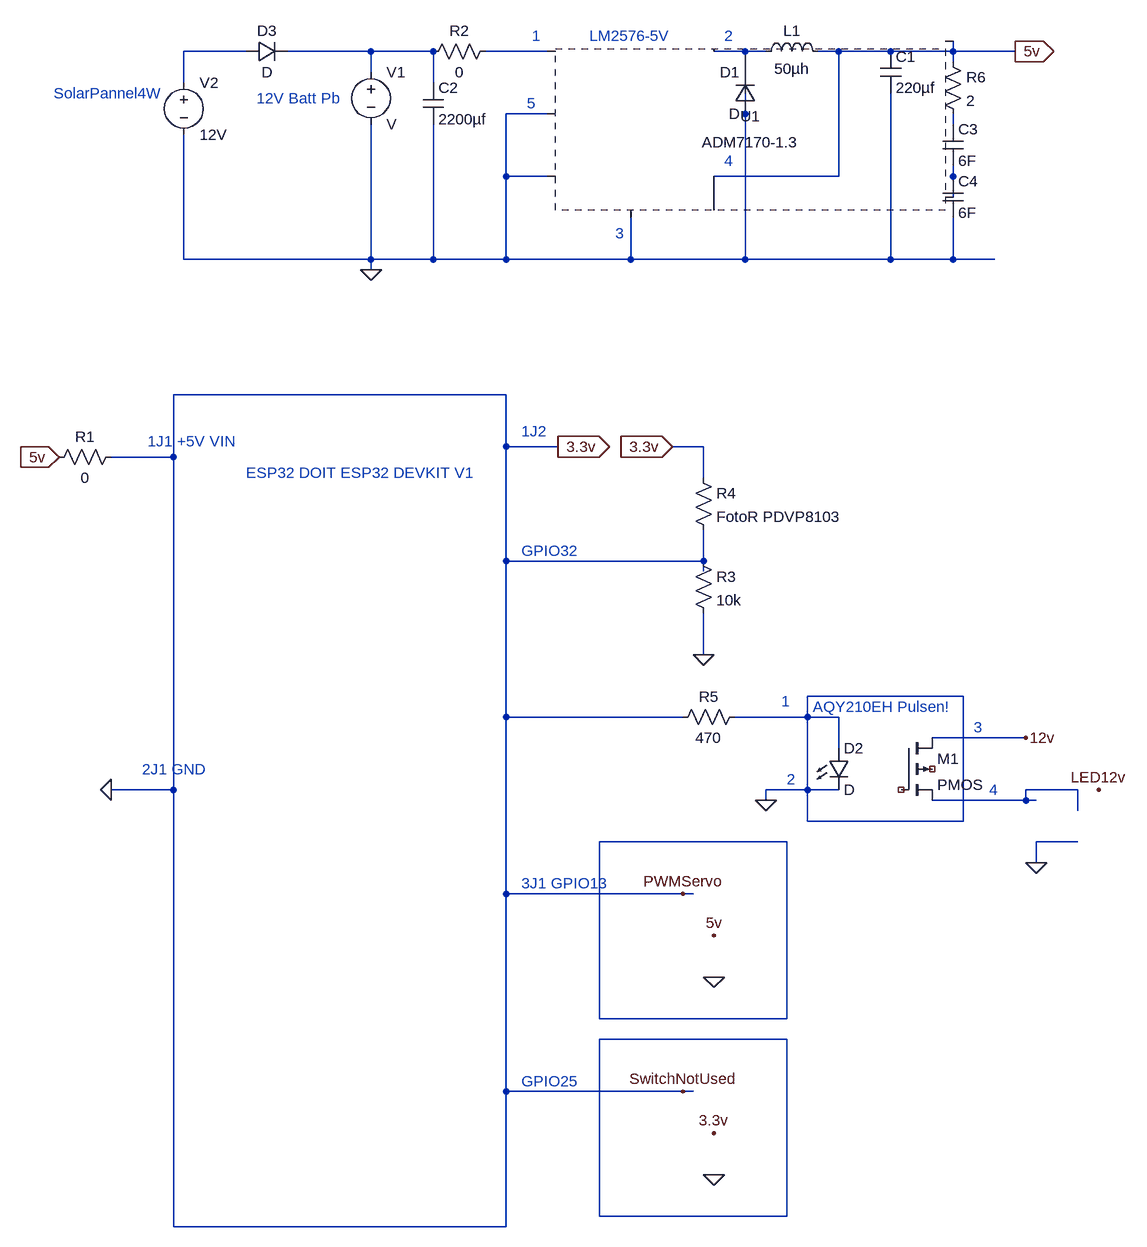
[diagram p0: schematic LTSPICE_Schematics.asc]
LTSPICE_Schematics.asc, the LTspice schematic file:
Version 4
SHEET 1 2716 1220
WIRE 1344 -592 1248 -592
WIRE 1536 -592 1408 -592
WIRE 1632 -592 1536 -592
WIRE 1808 -592 1712 -592
WIRE 2112 -592 2064 -592
WIRE 2144 -592 2112 -592
WIRE 2256 -592 2224 -592
WIRE 2336 -592 2256 -592
WIRE 2432 -592 2432 -608
WIRE 2432 -592 2336 -592
WIRE 2528 -592 2432 -592
WIRE 2432 -576 2432 -592
WIRE 1536 -560 1536 -592
WIRE 2112 -560 2112 -592
WIRE 1248 -544 1248 -592
WIRE 1632 -544 1632 -592
WIRE 1808 -496 1744 -496
WIRE 2112 -496 2112 -528
WIRE 2432 -480 2432 -496
WIRE 1744 -400 1744 -496
WIRE 1808 -400 1744 -400
WIRE 2256 -400 2256 -592
WIRE 2256 -400 2064 -400
WIRE 2432 -400 2432 -416
WIRE 2432 -368 2432 -400
WIRE 1248 -272 1248 -464
WIRE 1536 -272 1536 -480
WIRE 1536 -272 1248 -272
WIRE 1632 -272 1632 -480
WIRE 1632 -272 1536 -272
WIRE 1744 -272 1744 -400
WIRE 1744 -272 1632 -272
WIRE 1936 -272 1936 -336
WIRE 1936 -272 1744 -272
WIRE 2112 -272 2112 -496
WIRE 2112 -272 1936 -272
WIRE 2336 -272 2336 -528
WIRE 2336 -272 2112 -272
WIRE 2432 -272 2432 -336
WIRE 2432 -272 2336 -272
WIRE 2496 -272 2432 -272
WIRE 1536 -256 1536 -272
WIRE 1744 -64 1232 -64
WIRE 1744 16 1744 -64
WIRE 1824 16 1744 16
WIRE 2048 16 2000 16
WIRE 1232 32 1232 -64
WIRE 1232 32 1136 32
WIRE 2048 64 2048 16
WIRE 1744 192 1744 16
WIRE 2048 192 2048 144
WIRE 2048 192 1744 192
WIRE 2048 208 2048 192
WIRE 2048 336 2048 272
WIRE 2448 400 2208 400
WIRE 1744 432 1744 192
WIRE 2016 432 1744 432
WIRE 2208 432 2208 400
WIRE 2208 432 2096 432
WIRE 2256 432 2208 432
WIRE 2544 464 2400 464
WIRE 2256 480 2256 432
WIRE 1232 544 1232 32
WIRE 1232 544 1136 544
WIRE 2208 544 2208 432
WIRE 2208 544 2144 544
WIRE 2256 544 2208 544
WIRE 2624 544 2544 544
WIRE 2144 560 2144 544
WIRE 2544 560 2544 544
WIRE 2544 560 2400 560
WIRE 2560 560 2544 560
WIRE 2624 576 2624 544
WIRE 2208 592 2208 544
WIRE 2448 592 2448 400
WIRE 2448 592 2208 592
WIRE 2176 624 1888 624
WIRE 2624 624 2560 624
WIRE 2560 656 2560 624
WIRE 1744 704 1744 432
WIRE 2016 704 1744 704
WIRE 2032 704 2016 704
WIRE 1888 896 1888 624
WIRE 2176 896 2176 624
WIRE 2176 896 1888 896
WIRE 2176 928 1888 928
WIRE 1744 1008 1744 704
WIRE 2016 1008 1744 1008
WIRE 2032 1008 2016 1008
WIRE 1888 1200 1888 928
WIRE 2176 1200 2176 928
WIRE 2176 1200 1888 1200
WIRE 1232 1216 1232 544
WIRE 1744 1216 1744 1008
WIRE 1744 1216 1232 1216
FLAG 1536 -256 0
FLAG 2528 -592 5v
IOPIN 2528 -592 Out
FLAG 1056 32 5v
IOPIN 1056 32 In
FLAG 1136 544 0
FLAG 2048 336 0
FLAG 2000 16 3.3v
IOPIN 2000 16 In
FLAG 1824 16 3.3v
IOPIN 1824 16 Out
FLAG 2544 464 12v
FLAG 2656 544 LED12v
FLAG 2560 656 0
FLAG 2064 768 5v
FLAG 2016 704 PWMServo
FLAG 2064 832 0
FLAG 2144 560 0
FLAG 2064 1072 3.3v
FLAG 2016 1008 SwitchNotUsed
FLAG 2064 1136 0
SYMBOL PowerProducts\\ADM7170-1.3 1936 -496 R0
SYMATTR InstName U1
SYMBOL voltage 1536 -576 R0
SYMATTR InstName V1
SYMBOL ind 2128 -576 R270
WINDOW 0 32 56 VTop 2
WINDOW 3 5 56 VBottom 2
SYMATTR InstName L1
SYMATTR Value 50µh
SYMBOL cap 2320 -592 R0
SYMATTR InstName C1
SYMATTR Value 220µf
SYMBOL cap 1616 -544 R0
SYMATTR InstName C2
SYMATTR Value 2200µf
SYMBOL res 1152 16 R90
WINDOW 0 0 56 VBottom 2
WINDOW 3 32 56 VTop 2
SYMATTR InstName R1
SYMATTR Value 0
SYMBOL res 1728 -608 R90
WINDOW 0 0 56 VBottom 2
WINDOW 3 32 56 VTop 2
SYMATTR InstName R2
SYMATTR Value 0
SYMBOL res 2032 176 R0
SYMATTR InstName R3
SYMATTR Value 10k
SYMBOL res 2032 48 R0
SYMATTR InstName R4
SYMATTR Value FotoR PDVP8103
SYMBOL LED 2240 480 R0
SYMATTR InstName D2
SYMBOL pmos4 2352 464 R0
SYMATTR InstName M1
SYMBOL res 2112 416 R90
WINDOW 0 0 56 VBottom 2
WINDOW 3 32 56 VTop 2
SYMATTR InstName R5
SYMATTR Value 470
SYMBOL diode 2128 -496 R180
WINDOW 0 24 64 Left 2
WINDOW 3 24 0 Left 2
SYMATTR InstName D1
SYMBOL cap 2416 -480 R0
SYMATTR InstName C3
SYMATTR Value 6F
SYMATTR SpiceLine V=2.7
SYMBOL cap 2416 -400 R0
SYMATTR InstName C4
SYMATTR Value 6F
SYMATTR SpiceLine V=2.7
SYMBOL res 2416 -592 R0
SYMATTR InstName R6
SYMATTR Value 2
SYMBOL voltage 1248 -560 R0
WINDOW 123 0 0 Left 0
WINDOW 39 0 0 Left 0
SYMATTR InstName V2
SYMATTR Value 12V
SYMBOL diode 1344 -576 R270
WINDOW 0 32 32 VTop 2
WINDOW 3 0 32 VBottom 2
SYMATTR InstName D3
TEXT 1872 -616 Left 2 ;LM2576-5V
TEXT 1360 -520 Left 2 ;12V Batt Pb
TEXT 1784 -616 Left 2 ;1
TEXT 2080 -616 Left 2 ;2
TEXT 2080 -424 Left 2 ;4
TEXT 1912 -312 Left 2 ;3
TEXT 1776 -512 Left 2 ;5
TEXT 1344 56 Left 2 ;ESP32 DOIT ESP32 DEVKIT V1
TEXT 1184 512 Left 2 ;2J1 GND
TEXT 1192 8 Left 2 ;1J1 +5V VIN
TEXT 1768 176 Left 2 ;GPIO32
TEXT 1768 -8 Left 2 ;1J2
TEXT 2216 416 Left 2 ;AQY210EH Pulsen!
TEXT 2168 408 Left 2 ;1
TEXT 2176 528 Left 2 ;2
TEXT 2464 448 Left 2 ;3
TEXT 2488 544 Left 2 ;4
TEXT 1768 688 Left 2 ;3J1 GPIO13
TEXT 1768 992 Left 2 ;GPIO25
TEXT 1048 -528 Left 2 ;SolarPannel4W

The netlist it stands for:
* LTSPICE_Schematics.asc
* U1: ADM7170-1.3 (symbol PowerProducts\ADM7170-1.3 not available, pin order unknown); nets seen at it: 0, 5v, N003, N004, N006
V1 N002 0 V
L1 N004 5v 50µh
C1 5v 0 220µf
C2 N002 0 2200µf
R1 0 5v 0
R2 N003 N002 0
R3 0 0 10k
R4 0 0 FotoR PDVP8103
D2 0 0 D
M1 12v NC_01 N007 NC_02 PMOS
R5 0 0 470
D1 0 N004 D
C3 N005 N006 6F V=2.7
C4 N006 0 6F V=2.7
R6 5v N005 2
V2 N001 0 12V
D3 N001 N002 D
.model D D
.lib standard.dio
.model NMOS NMOS
.model PMOS PMOS
.lib standard.mos
* LM2576-5V
* 12V Batt Pb
* 1
* 2
* 4
* 3
* 5
* ESP32 DOIT ESP32 DEVKIT V1
* 2J1 GND
* 1J1 +5V VIN
* GPIO32
* 1J2
* AQY210EH Pulsen!
* 1
* 2
* 3
* 4
* 3J1 GPIO13
* GPIO25
* SolarPannel4W
.backanno
.end